# Altium schematic sheet FPGA 1.SCHDOC: FPGA Rack
size 420 x 297 mm; DrawnBy: zas; Revision: V1.0; SheetNumber: 5; SheetTotal: 25; DocumentName: FPGA 1.SCHDOC
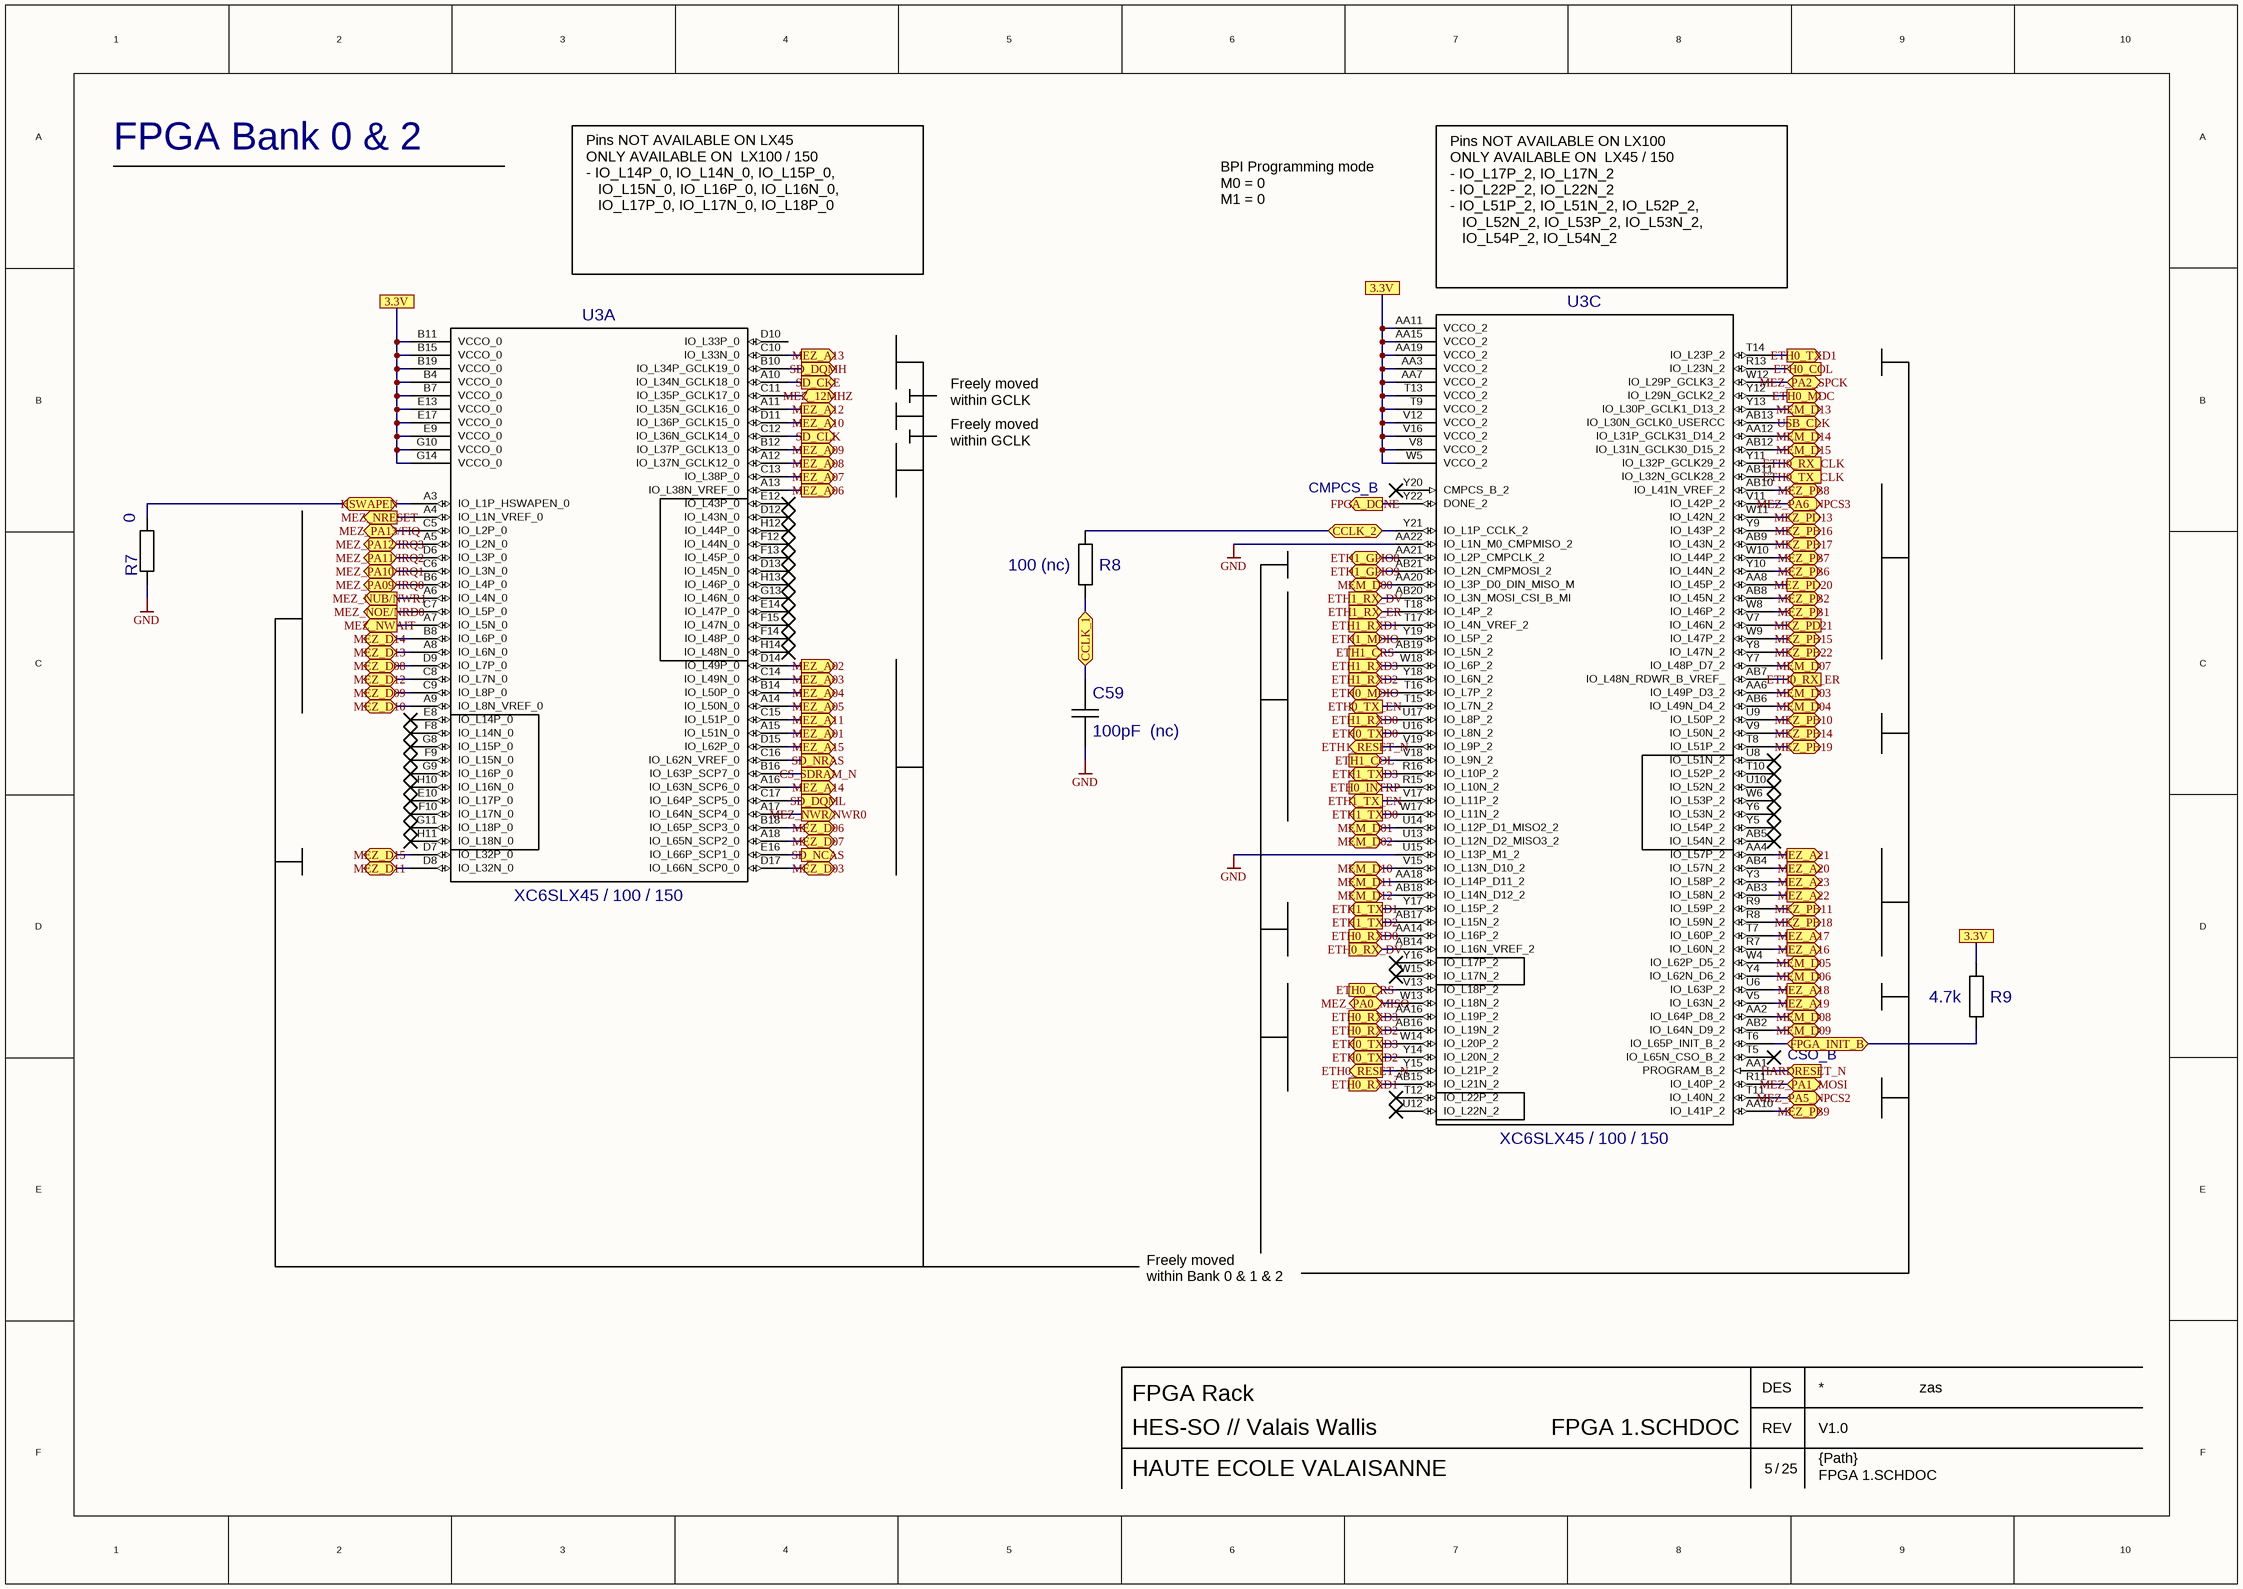
[diagram p0: FPGA 1.SCHDOC]

## Parts
C59  value 100pF  (nc)  [CC0805-MM]  (hidden comment: CAPS0805-MM)
R7  value 0  [RC0805-MM]  (hidden comment: RS0805-MM)
R8  value 100 (nc)  [RC0805-MM]  (hidden comment: RS0805-MM)
R9  value 4.7k  [RC0805-MM]  (hidden comment: RS0805-MM)
U3  value XC6SLX45 / 100 / 150  [BGA23X23-FG484]  (hidden comment: XC6SLX150 FGG484)  (parts A,C of 5)

## Ports
3.3V, CCLK_1 (bidir), CCLK_2 (bidir), CS_SDRAM_N (out), ETH0_COL (in), ETH0_CRS (in), ETH0_INTRP (in), ETH0_MDC (out), ETH0_MDIO (bidir), ETH0_RESET_N (out), ETH0_RX_CLK (in), ETH0_RX_DV (in), ETH0_RX_ER (in), ETH0_RXD0 (in), ETH0_RXD1 (in), ETH0_RXD2 (in), ETH0_RXD3 (in), ETH0_TX_CLK (in), ETH0_TX_EN (out), ETH0_TXD0 (out), ETH0_TXD1 (out), ETH0_TXD2 (out), ETH0_TXD3 (out), ETH1_COL (in), ETH1_CRS (in), ETH1_GPIO8 (bidir), ETH1_GPIO9 (bidir), ETH1_MDIO (bidir), ETH1_RESET_N (out), ETH1_RX_DV (in), ETH1_RX_ER (in), ETH1_RXD0 (in), ETH1_RXD1 (in), ETH1_RXD2 (in), ETH1_RXD3 (in), ETH1_TX_EN (out), ETH1_TXD0 (out), ETH1_TXD1 (out), ETH1_TXD2 (out), ETH1_TXD3 (out), FPGA_DONE (out), FPGA_INIT_B (bidir), HARDRESET_N (in), HSWAPEN (bidir), MEM_D00 (bidir), MEM_D01 (bidir), MEM_D02 (bidir), MEM_D03 (bidir), MEM_D04 (bidir), MEM_D05 (bidir), MEM_D06 (bidir), MEM_D07 (bidir), MEM_D08 (bidir), MEM_D09 (bidir), MEM_D10 (bidir), MEM_D11 (bidir), MEM_D12 (bidir), MEM_D13 (bidir), MEM_D14 (bidir), MEM_D15 (bidir), MEZ_12MHZ (bidir), MEZ_A01 (out), MEZ_A02 (out), MEZ_A03 (out), MEZ_A04 (out), MEZ_A05 (out), MEZ_A06 (out), MEZ_A07 (out), MEZ_A08 (out), MEZ_A09 (out), MEZ_A10 (out), MEZ_A11 (out), MEZ_A12 (out), MEZ_A13 (out), MEZ_A14 (out), MEZ_A15 (out), MEZ_A16 (out), MEZ_A17 (out), MEZ_A18 (out), MEZ_A19 (out), MEZ_A20 (out), MEZ_A21 (out), MEZ_A22 (out), MEZ_A23 (out), MEZ_D03 (bidir), MEZ_D06 (bidir), MEZ_D07 (bidir), MEZ_D08 (bidir), MEZ_D09 (bidir), MEZ_D10 (bidir), MEZ_D11 (bidir), MEZ_D12 (bidir), MEZ_D13 (bidir), MEZ_D14 (bidir), MEZ_D15 (bidir), MEZ_NOE/NRD0 (out), MEZ_NRESET (out), MEZ_NUB/NWR1 (out), MEZ_NWAIT (out), MEZ_NWR/NWR0 (out), MEZ_PA0_MISO (bidir), MEZ_PA1_MOSI (bidir), MEZ_PA2_SPCK (bidir), MEZ_PA5_NPCS2 (bidir), MEZ_PA6_NPCS3 (bidir), MEZ_PA09/IRQ0 (bidir), MEZ_PA10/IRQ1 (bidir), MEZ_PA11/IRQ2 (bidir), MEZ_PA12/IRQ3 (bidir), MEZ_PA13/FIQ (bidir), MEZ_PB1 (bidir), MEZ_PB2 (bidir), MEZ_PB6 (bidir), MEZ_PB7 (bidir), MEZ_PB8 (bidir), MEZ_PB9 (bidir), MEZ_PB10 (bidir), MEZ_PB11 (bidir), MEZ_PB14 (bidir), MEZ_PB15 (bidir), MEZ_PB16 (bidir), MEZ_PB17 (bidir), MEZ_PB18 (bidir), MEZ_PB19 (bidir), MEZ_PB22 (bidir), MEZ_PD13 (bidir), MEZ_PD20 (out), MEZ_PD21 (in), SD_CKE (out), SD_CLK (out), SD_DQMH (out), SD_DQML (out), SD_NCAS (out), SD_NRAS (out), USB_CLK (out)

## Nets
GND: C59.1 R7.1 U3.AA22(IO_L1N_M0_CMPMISO_2) U3.U15(IO_L13P_M1_2)
CCLK_1: C59.2 R8.1 ; port CCLK_1
CCLK_2: R8.2 U3.Y21(IO_L1P_CCLK_2) ; port CCLK_2
CS_SDRAM_N: U3.B16(IO_L63P_SCP7_0) ; port CS_SDRAM_N
ETH0_COL: U3.R13(IO_L23N_2) ; port ETH0_COL
ETH0_CRS: U3.V13(IO_L18P_2) ; port ETH0_CRS
ETH0_INTRP: U3.R15(IO_L10N_2) ; port ETH0_INTRP
ETH0_MDC: U3.Y12(IO_L29N_GCLK2_2) ; port ETH0_MDC
ETH0_MDIO: U3.T16(IO_L7P_2) ; port ETH0_MDIO
ETH0_RESET_N: U3.Y15(IO_L21P_2) ; port ETH0_RESET_N
ETH0_RX_CLK: U3.Y11(IO_L32P_GCLK29_2) ; port ETH0_RX_CLK
ETH0_RX_DV: U3.AB14(IO_L16N_VREF_2) ; port ETH0_RX_DV
ETH0_RX_ER: U3.AB7(IO_L48N_RDWR_B_VREF_) ; port ETH0_RX_ER
ETH0_RXD0: U3.AA14(IO_L16P_2) ; port ETH0_RXD0
ETH0_RXD1: U3.AB15(IO_L21N_2) ; port ETH0_RXD1
ETH0_RXD2: U3.AB16(IO_L19N_2) ; port ETH0_RXD2
ETH0_RXD3: U3.AA16(IO_L19P_2) ; port ETH0_RXD3
ETH0_TX_CLK: U3.AB11(IO_L32N_GCLK28_2) ; port ETH0_TX_CLK
ETH0_TX_EN: U3.T15(IO_L7N_2) ; port ETH0_TX_EN
ETH0_TXD0: U3.U16(IO_L8N_2) ; port ETH0_TXD0
ETH0_TXD1: U3.T14(IO_L23P_2) ; port ETH0_TXD1
ETH0_TXD2: U3.Y14(IO_L20N_2) ; port ETH0_TXD2
ETH0_TXD3: U3.W14(IO_L20P_2) ; port ETH0_TXD3
ETH1_COL: U3.V18(IO_L9N_2) ; port ETH1_COL
ETH1_CRS: U3.AB19(IO_L5N_2) ; port ETH1_CRS
ETH1_GPIO8: U3.AA21(IO_L2P_CMPCLK_2) ; port ETH1_GPIO8
ETH1_GPIO9: U3.AB21(IO_L2N_CMPMOSI_2) ; port ETH1_GPIO9
ETH1_MDIO: U3.Y19(IO_L5P_2) ; port ETH1_MDIO
ETH1_RESET_N: U3.V19(IO_L9P_2) ; port ETH1_RESET_N
ETH1_RX_DV: U3.AB20(IO_L3N_MOSI_CSI_B_MI) ; port ETH1_RX_DV
ETH1_RX_ER: U3.T18(IO_L4P_2) ; port ETH1_RX_ER
ETH1_RXD0: U3.U17(IO_L8P_2) ; port ETH1_RXD0
ETH1_RXD1: U3.T17(IO_L4N_VREF_2) ; port ETH1_RXD1
ETH1_RXD2: U3.Y18(IO_L6N_2) ; port ETH1_RXD2
ETH1_RXD3: U3.W18(IO_L6P_2) ; port ETH1_RXD3
ETH1_TX_EN: U3.V17(IO_L11P_2) ; port ETH1_TX_EN
ETH1_TXD0: U3.W17(IO_L11N_2) ; port ETH1_TXD0
ETH1_TXD1: U3.Y17(IO_L15P_2) ; port ETH1_TXD1
ETH1_TXD2: U3.AB17(IO_L15N_2) ; port ETH1_TXD2
ETH1_TXD3: U3.R16(IO_L10P_2) ; port ETH1_TXD3
FPGA_DONE: U3.Y22(DONE_2) ; port FPGA_DONE
FPGA_INIT_B: R9.2 U3.T6(IO_L65P_INIT_B_2) ; port FPGA_INIT_B
HARDRESET_N: U3.AA1(PROGRAM_B_2) ; port HARDRESET_N
HSWAPEN: R7.2 U3.A3(IO_L1P_HSWAPEN_0) ; port HSWAPEN
MEM_D00: U3.AA20(IO_L3P_D0_DIN_MISO_M) ; port MEM_D00
MEM_D01: U3.U14(IO_L12P_D1_MISO2_2) ; port MEM_D01
MEM_D02: U3.U13(IO_L12N_D2_MISO3_2) ; port MEM_D02
MEM_D03: U3.AA6(IO_L49P_D3_2) ; port MEM_D03
MEM_D04: U3.AB6(IO_L49N_D4_2) ; port MEM_D04
MEM_D05: U3.W4(IO_L62P_D5_2) ; port MEM_D05
MEM_D06: U3.Y4(IO_L62N_D6_2) ; port MEM_D06
MEM_D07: U3.Y7(IO_L48P_D7_2) ; port MEM_D07
MEM_D08: U3.AA2(IO_L64P_D8_2) ; port MEM_D08
MEM_D09: U3.AB2(IO_L64N_D9_2) ; port MEM_D09
MEM_D10: U3.V15(IO_L13N_D10_2) ; port MEM_D10
MEM_D11: U3.AA18(IO_L14P_D11_2) ; port MEM_D11
MEM_D12: U3.AB18(IO_L14N_D12_2) ; port MEM_D12
MEM_D13: U3.Y13(IO_L30P_GCLK1_D13_2) ; port MEM_D13
MEM_D14: U3.AA12(IO_L31P_GCLK31_D14_2) ; port MEM_D14
MEM_D15: U3.AB12(IO_L31N_GCLK30_D15_2) ; port MEM_D15
MEZ_12MHZ: U3.C11(IO_L35P_GCLK17_0) ; port MEZ_12MHZ
MEZ_A01: U3.A15(IO_L51N_0) ; port MEZ_A01
MEZ_A02: U3.D14(IO_L49P_0) ; port MEZ_A02
MEZ_A03: U3.C14(IO_L49N_0) ; port MEZ_A03
MEZ_A04: U3.B14(IO_L50P_0) ; port MEZ_A04
MEZ_A05: U3.A14(IO_L50N_0) ; port MEZ_A05
MEZ_A06: U3.A13(IO_L38N_VREF_0) ; port MEZ_A06
MEZ_A07: U3.C13(IO_L38P_0) ; port MEZ_A07
MEZ_A08: U3.A12(IO_L37N_GCLK12_0) ; port MEZ_A08
MEZ_A09: U3.B12(IO_L37P_GCLK13_0) ; port MEZ_A09
MEZ_A10: U3.D11(IO_L36P_GCLK15_0) ; port MEZ_A10
MEZ_A11: U3.C15(IO_L51P_0) ; port MEZ_A11
MEZ_A12: U3.A11(IO_L35N_GCLK16_0) ; port MEZ_A12
MEZ_A13: U3.C10(IO_L33N_0) ; port MEZ_A13
MEZ_A14: U3.A16(IO_L63N_SCP6_0) ; port MEZ_A14
MEZ_A15: U3.D15(IO_L62P_0) ; port MEZ_A15
MEZ_A16: U3.R7(IO_L60N_2) ; port MEZ_A16
MEZ_A17: U3.T7(IO_L60P_2) ; port MEZ_A17
MEZ_A18: U3.U6(IO_L63P_2) ; port MEZ_A18
MEZ_A19: U3.V5(IO_L63N_2) ; port MEZ_A19
MEZ_A20: U3.AB4(IO_L57N_2) ; port MEZ_A20
MEZ_A21: U3.AA4(IO_L57P_2) ; port MEZ_A21
MEZ_A22: U3.AB3(IO_L58N_2) ; port MEZ_A22
MEZ_A23: U3.Y3(IO_L58P_2) ; port MEZ_A23
MEZ_D03: U3.D17(IO_L66N_SCP0_0) ; port MEZ_D03
MEZ_D06: U3.B18(IO_L65P_SCP3_0) ; port MEZ_D06
MEZ_D07: U3.A18(IO_L65N_SCP2_0) ; port MEZ_D07
MEZ_D08: U3.D9(IO_L7P_0) ; port MEZ_D08
MEZ_D09: U3.C9(IO_L8P_0) ; port MEZ_D09
MEZ_D10: U3.A9(IO_L8N_VREF_0) ; port MEZ_D10
MEZ_D11: U3.D8(IO_L32N_0) ; port MEZ_D11
MEZ_D12: U3.C8(IO_L7N_0) ; port MEZ_D12
MEZ_D13: U3.A8(IO_L6N_0) ; port MEZ_D13
MEZ_D14: U3.B8(IO_L6P_0) ; port MEZ_D14
MEZ_D15: U3.D7(IO_L32P_0) ; port MEZ_D15
MEZ_NOE/NRD0: U3.C7(IO_L5P_0) ; port MEZ_NOE/NRD0
MEZ_NRESET: U3.A4(IO_L1N_VREF_0) ; port MEZ_NRESET
MEZ_NUB/NWR1: U3.A6(IO_L4N_0) ; port MEZ_NUB/NWR1
MEZ_NWAIT: U3.A7(IO_L5N_0) ; port MEZ_NWAIT
MEZ_NWR/NWR0: U3.A17(IO_L64N_SCP4_0) ; port MEZ_NWR/NWR0
MEZ_PA0_MISO: U3.W13(IO_L18N_2) ; port MEZ_PA0_MISO
MEZ_PA1_MOSI: U3.R11(IO_L40P_2) ; port MEZ_PA1_MOSI
MEZ_PA2_SPCK: U3.W12(IO_L29P_GCLK3_2) ; port MEZ_PA2_SPCK
MEZ_PA5_NPCS2: U3.T11(IO_L40N_2) ; port MEZ_PA5_NPCS2
MEZ_PA6_NPCS3: U3.V11(IO_L42P_2) ; port MEZ_PA6_NPCS3
MEZ_PA09/IRQ0: U3.B6(IO_L4P_0) ; port MEZ_PA09/IRQ0
MEZ_PA10/IRQ1: U3.C6(IO_L3N_0) ; port MEZ_PA10/IRQ1
MEZ_PA11/IRQ2: U3.D6(IO_L3P_0) ; port MEZ_PA11/IRQ2
MEZ_PA12/IRQ3: U3.A5(IO_L2N_0) ; port MEZ_PA12/IRQ3
MEZ_PA13/FIQ: U3.C5(IO_L2P_0) ; port MEZ_PA13/FIQ
MEZ_PB1: U3.W8(IO_L46P_2) ; port MEZ_PB1
MEZ_PB2: U3.AB8(IO_L45N_2) ; port MEZ_PB2
MEZ_PB6: U3.Y10(IO_L44N_2) ; port MEZ_PB6
MEZ_PB7: U3.W10(IO_L44P_2) ; port MEZ_PB7
MEZ_PB8: U3.AB10(IO_L41N_VREF_2) ; port MEZ_PB8
MEZ_PB9: U3.AA10(IO_L41P_2) ; port MEZ_PB9
MEZ_PB10: U3.U9(IO_L50P_2) ; port MEZ_PB10
MEZ_PB11: U3.R9(IO_L59P_2) ; port MEZ_PB11
MEZ_PB14: U3.V9(IO_L50N_2) ; port MEZ_PB14
MEZ_PB15: U3.W9(IO_L47P_2) ; port MEZ_PB15
MEZ_PB16: U3.Y9(IO_L43P_2) ; port MEZ_PB16
MEZ_PB17: U3.AB9(IO_L43N_2) ; port MEZ_PB17
MEZ_PB18: U3.R8(IO_L59N_2) ; port MEZ_PB18
MEZ_PB19: U3.T8(IO_L51P_2) ; port MEZ_PB19
MEZ_PB22: U3.Y8(IO_L47N_2) ; port MEZ_PB22
MEZ_PD13: U3.W11(IO_L42N_2) ; port MEZ_PD13
MEZ_PD20: U3.AA8(IO_L45P_2) ; port MEZ_PD20
MEZ_PD21: U3.V7(IO_L46N_2) ; port MEZ_PD21
SD_CKE: U3.A10(IO_L34N_GCLK18_0) ; port SD_CKE
SD_CLK: U3.C12(IO_L36N_GCLK14_0) ; port SD_CLK
SD_DQMH: U3.B10(IO_L34P_GCLK19_0) ; port SD_DQMH
SD_DQML: U3.C17(IO_L64P_SCP5_0) ; port SD_DQML
SD_NCAS: U3.E16(IO_L66P_SCP1_0) ; port SD_NCAS
SD_NRAS: U3.C16(IO_L62N_VREF_0) ; port SD_NRAS
USB_CLK: U3.AB13(IO_L30N_GCLK0_USERCC) ; port USB_CLK
NetU3_AA3: U3.AA3(VCCO_2) U3.AA7(VCCO_2) U3.AA11(VCCO_2) U3.AA15(VCCO_2) U3.AA19(VCCO_2) U3.T9(VCCO_2) U3.T13(VCCO_2) U3.V8(VCCO_2) U3.V12(VCCO_2) U3.V16(VCCO_2) U3.W5(VCCO_2)
NetU3_B4: U3.B4(VCCO_0) U3.B7(VCCO_0) U3.B11(VCCO_0) U3.B15(VCCO_0) U3.B19(VCCO_0) U3.E9(VCCO_0) U3.E13(VCCO_0) U3.E17(VCCO_0) U3.G10(VCCO_0) U3.G14(VCCO_0)

Not connected (* = marked no-connect by the designer): R9 1; U3 AB5(IO_L54N_2) D10(IO_L33P_0) D12(IO_L43N_0) D13(IO_L45N_0) E8(IO_L14P_0) E10(IO_L17P_0) E12(IO_L43P_0) E14(IO_L47P_0) F8(IO_L14N_0) F9(IO_L15N_0) F10(IO_L17N_0) F12(IO_L44N_0) F13(IO_L45P_0) F14(IO_L48P_0) F15(IO_L47N_0) G8(IO_L15P_0) G9(IO_L16P_0) G11(IO_L18P_0) G13(IO_L46N_0) H10(IO_L16N_0) H11(IO_L18N_0) H12(IO_L44P_0) H13(IO_L46P_0) H14(IO_L48N_0) T5(IO_L65N_CSO_B_2) T10(IO_L52P_2) T12(IO_L22P_2) U8(IO_L51N_2) U10(IO_L52N_2) U12(IO_L22N_2) W6(IO_L53P_2) W15(IO_L17N_2) Y5(IO_L54P_2) Y6(IO_L53N_2) Y16(IO_L17P_2) Y20(CMPCS_B_2)

## Notes on the sheet
- FPGA Bank 0 & 2
- Pins NOT AVAILABLE ON LX45
  ONLY AVAILABLE ON  LX100 / 150
  - IO_L14P_0, IO_L14N_0, IO_L15P_0,
  IO_L15N_0, IO_L16P_0, IO_L16N_0,
  IO_L17P_0, IO_L17N_0, IO_L18P_0
- BPI Programming mode
  M0 = 0
  M1 = 0
- (near U3) Pins NOT AVAILABLE ON LX100
  ONLY AVAILABLE ON  LX45 / 150
  - IO_L17P_2, IO_L17N_2
  - IO_L22P_2, IO_L22N_2
  - IO_L51P_2, IO_L51N_2, IO_L52P_2,
  IO_L52N_2, IO_L53P_2, IO_L53N_2,
  IO_L54P_2, IO_L54N_2
- Freely moved
  within GCLK
- CMPCS_B
- CSO_B
- Freely moved
  within Bank 0 & 1 & 2
- DES
- HES-SO // Valais Wallis
- HAUTE ECOLE VALAISANNE
- /
- REV
- {Path}

## Library data of the parts
C59 = CAPS0805-MM: Capacitor
R7 = RS0805-MM: Partition: FPGA Config; RefDes2: {RefDes2}; MEZZAONLY: YES